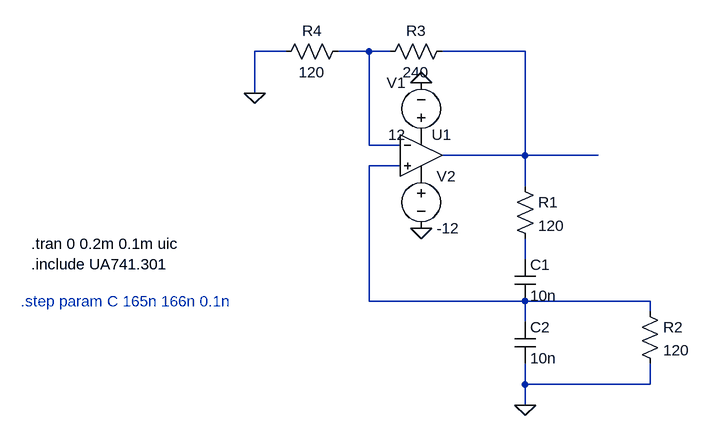
[diagram p0: schematic Draft4.asc]
Draft4.asc, the LTspice schematic file:
Version 4
SHEET 1 880 688
WIRE 144 128 96 128
WIRE 272 128 224 128
WIRE 304 128 272 128
WIRE 512 128 384 128
WIRE 96 192 96 128
WIRE 272 272 272 128
WIRE 320 272 272 272
WIRE 512 288 512 128
WIRE 512 288 384 288
WIRE 624 288 512 288
WIRE 320 304 272 304
WIRE 512 336 512 288
WIRE 512 448 512 416
WIRE 272 512 272 304
WIRE 512 512 272 512
WIRE 704 512 512 512
WIRE 704 528 704 512
WIRE 512 544 512 512
WIRE 512 640 512 608
WIRE 704 640 704 608
WIRE 704 640 512 640
WIRE 512 672 512 640
FLAG 512 672 0
FLAG 96 192 0
FLAG 352 400 0
FLAG 352 176 0
SYMBOL res 496 320 R0
SYMATTR InstName R1
SYMATTR Value 120
SYMBOL res 688 512 R0
SYMATTR InstName R2
SYMATTR Value 120
SYMBOL cap 496 448 R0
SYMATTR InstName C1
SYMATTR Value 10n
SYMBOL cap 496 544 R0
SYMATTR InstName C2
SYMATTR Value 10n
SYMBOL res 400 112 R90
WINDOW 0 0 56 VBottom 2
WINDOW 3 32 56 VTop 2
SYMATTR InstName R3
SYMATTR Value 240
SYMBOL res 240 112 R90
WINDOW 0 0 56 VBottom 2
WINDOW 3 32 56 VTop 2
SYMATTR InstName R4
SYMATTR Value 120
SYMBOL voltage 352 272 R180
WINDOW 0 24 96 Left 2
WINDOW 3 24 16 Left 2
SYMATTR InstName V1
SYMATTR Value 12
SYMBOL voltage 352 304 R0
SYMATTR InstName V2
SYMATTR Value -12
SYMBOL OpAmps/UniversalOpAmp1 352 288 R0
SYMATTR InstName U1
TEXT -248 424 Left 2 !.tran 0 0.2m 0.1m uic\n.include UA741.301
TEXT -264 512 Left 2 ;.step param C 165n 166n 0.1n

The netlist it stands for:
* Draft4.asc
R1 N002 N004 120
R2 N003 0 120
C1 N004 N003 10n
C2 N003 0 10n
R3 N002 N001 240
R4 N001 0 120
V1 P001 0 12
V2 P002 0 -12
XU1 N003 N001 P001 P002 N002 level1 Avol=1Meg GBW=10Meg Vos=0 En=0 Enk=0 In=0 Ink=0 Rin=500Meg  ; pins In+ In- V+ V- OUT
.tran 0 0.2m 0.1m uic
.include UA741.301
* .step param C 165n 166n 0.1n
.lib UniversalOpAmp1.lib
.backanno
.end